# EAGLE design Pin-with-a-screen (EAGLE 7.6.0)
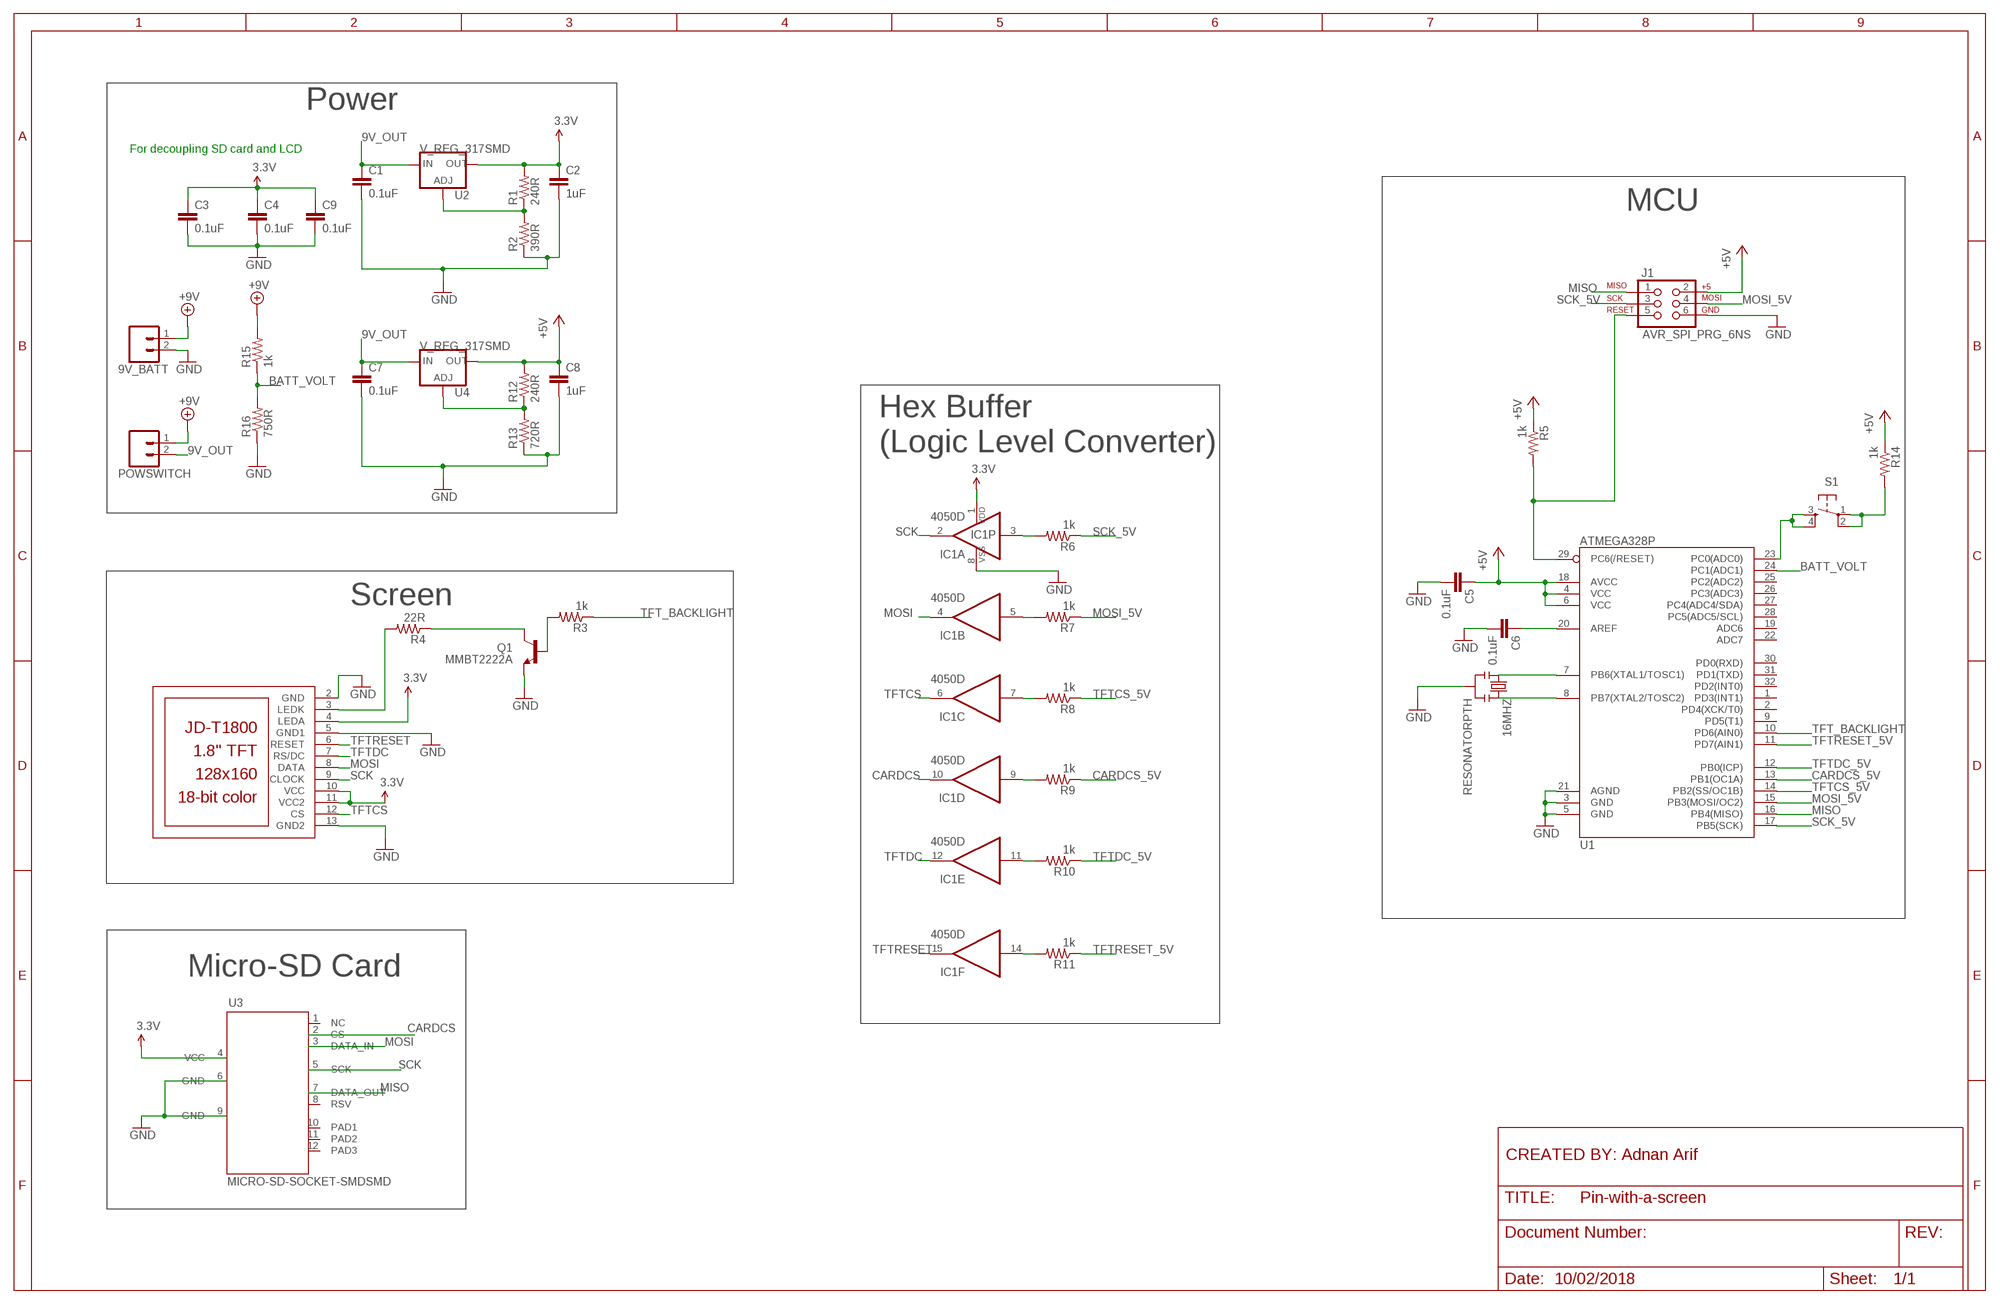
[diagram p0: schematic, sheet 1]
FRAME1 (FRAME_B_L): DATE: 10th Feb 2018

## Parts
9V_BATT  M02POGO_PIN_HOLES_ONLY  [1X02_PP_HOLES_ONLY]
16MHZ  RESONATORPTH  [RESONATOR-PTH]
C1  0.1uF  CAP0603-CAP  [0603-CAP]
C2  1uF  CAP0603-CAP  [0603-CAP]
C3  0.1uF  CAP0603-CAP  [0603-CAP]
C4  0.1uF  CAP0603-CAP  [0603-CAP]
C5  0.1uF  CAP0603-CAP  [0603-CAP]
C6  0.1uF  CAP0603-CAP  [0603-CAP]
C7  0.1uF  CAP0603-CAP  [0603-CAP]
C8  1uF  CAP0603-CAP  [0603-CAP]
C9  0.1uF  CAP0603-CAP  [0603-CAP]
IC1  4050D  [SO16]
J1  AVR_SPI_PRG_6NS  [2X3-NS]
LCD2  JD-T1800  [JD-T1800]
POWSWITCH  M02POGO_PIN_HOLES_ONLY  [1X02_PP_HOLES_ONLY]
Q1  MMBT2222A  TRANSISTOR_NPNMMBT2222A  [SOT23-3]
R1  240R  RESISTOR0603-RES  [0603-RES]
R2  390R  RESISTOR0603-RES  [0603-RES]
R3  1k  RESISTOR0603-RES  [0603-RES]
R4  22R  RESISTOR0603-RES  [0603-RES]
R5  1k  RESISTOR0603-RES  [0603-RES]
R6  1k  RESISTOR0603-RES  [0603-RES]
R7  1k  RESISTOR0603-RES  [0603-RES]
R8  1k  RESISTOR0603-RES  [0603-RES]
R9  1k  RESISTOR0603-RES  [0603-RES]
R10  1k  RESISTOR0603-RES  [0603-RES]
R11  1k  RESISTOR0603-RES  [0603-RES]
R12  240R  RESISTOR0603-RES  [0603-RES]
R13  720R  RESISTOR0603-RES  [0603-RES]
R14  1k  RESISTOR0603-RES  [0603-RES]
R15  1k  RESISTOR0603-RES  [0603-RES]
R16  750R  RESISTOR0603-RES  [0603-RES]
S1  TAC_SWITCHPTH  [TACTILE-PTH]
U1  ATMEGA328P  ATMEGA328_SMT  [TQFP32-08]
U2  V_REG_317SMD  [SOT223]
U3  MICRO-SD-SOCKET-SMDSMD  [MICRO-SD-SOCKET-SMD]
U4  V_REG_317SMD  [SOT223]

## Nets
3.3V: C2.1 C3.1 C4.1 C9.1 IC1.1(P:VDD) LCD2.4(LEDA) LCD2.10(VCC) LCD2.11(VCC2) R1.2 U2.2(OUT) U3.4(VCC)
9V_OUT: C1.1 C7.1 POWSWITCH.2 U2.3(IN) U4.3(IN)
+5V: C5.1 C8.1 J1.2 R5.1 R12.2 R14.1 U1.4(VCC) U1.6(VCC) U1.18(AVCC) U4.2(OUT)
+9V: 9V_BATT.1 POWSWITCH.1 R15.2
BATT_VOLT: R15.1 R16.2 U1.24(PC1(ADC1))
CARDCS: IC1.10(D:O) U3.2(CS)
CARDCS_5V: R9.1 U1.13(PB1(OC1A))
GND: 9V_BATT.2 16MHZ.2 C1.2 C2.2 C3.2 C4.2 C5.2 C6.2 C7.2 C8.2 C9.2 IC1.8(P:VSS) J1.6 LCD2.2(GND) LCD2.5(GND1) LCD2.13(GND2) Q1.2(E) R2.1 R13.1 R16.1 U1.3(GND) U1.5(GND) U1.21(AGND) U3.6(GND) U3.9(GND)
LEDK: LCD2.3(LEDK) R4.2
MISO: J1.1 U1.16(PB4(MISO)) U3.7(DATA_OUT)
MOSI: IC1.4(B:O) LCD2.8(DATA) U3.3(DATA_IN)
MOSI_5V: J1.4 R7.1 U1.15(PB3(MOSI/OC2))
N$1: S1.3 S1.4 U1.23(PC0(ADC0))
N$2: R14.2 S1.1 S1.2
N$3: C6.1 U1.20(AREF)
N$4: 16MHZ.1 U1.7(PB6(XTAL1/TOSC1))
N$5: 16MHZ.3 U1.8(PB7(XTAL2/TOSC2))
N$6: J1.5 R5.2 U1.29(PC6(/RESET))
N$7: IC1.3(A:I) R6.2
N$8: IC1.5(B:I) R7.2
N$9: IC1.7(C:I) R8.2
N$10: IC1.9(D:I) R9.2
N$11: IC1.11(E:I) R10.2
N$12: IC1.14(F:I) R11.2
N$14: R1.1 R2.2 U2.1(ADJ)
N$15: R12.1 R13.2 U4.1(ADJ)
SCK: IC1.2(A:O) LCD2.9(CLOCK) U3.5(SCK)
SCK_5V: J1.3 R6.1 U1.17(PB5(SCK))
TFT_BACKLIGHT: R3.1 U1.10(PD6(AIN0))
TFTCS: IC1.6(C:O) LCD2.12(CS)
TFTCS_5V: R8.1 U1.14(PB2(SS/OC1B))
TFTDC: IC1.12(E:O) LCD2.7(RS/DC)
TFTDC_5V: R10.1 U1.12(PB0(ICP))
TFTRESET: IC1.15(F:O) LCD2.6(RESET)
TFTRESET_5V: R11.1 U1.11(PD7(AIN1))
TRAN_BASE: Q1.1(B) R3.2
TRAN_COLLECTOR: Q1.3(C) R4.1
Unconnected: U1.1(PD3(INT1)) U1.2(PD4(XCK/T0)) U1.9(PD5(T1)) U1.19(ADC6) U1.22(ADC7) U1.25(PC2(ADC2)) U1.26(PC3(ADC3)) U1.27(PC4(ADC4/SDA)) U1.28(PC5(ADC5/SCL)) U1.30(PD0(RXD)) U1.31(PD1(TXD)) U1.32(PD2(INT0)) U3.1(NC) U3.8(RSV) U3.10(PAD1) U3.11(PAD2) U3.12(PAD3)

## Notes on the sheet
- Power
- For decoupling SD card and LCD
- MCU
- Hex Buffer
  (Logic Level Converter)
- Screen
- Micro-SD Card
- CREATED BY: Adnan Arif
- 10/02/2018

## Library data of the parts
9V_BATT POWSWITCH = SparkFun-Connectors:M02: Standard 2-pin 0.1" header. Use with - straight break away headers ( PRT-00116) - right angle break away headers (PRT-00553) - swiss pins (PRT-00743) - machine pins (PRT-00117) - female headers (PRT-00115) Molex polarized connector foot print use with: PRT-08233 with associated crimp pins and housings. 2.54_SCREWTERM for use with PRT-10571. 3.5mm Screw Terminal footprints for PRT-08084 5mm Screw Terminal footprints for use with PRT-08433
16MHZ = SparkFun:RESONATOR: Resonator Small SMD resonator. This is the itty bitty 10/20MHz resonators with built in caps. CSTCE10M0G55 and CSTCE20M0V53. Footprint has been reviewed closely but hasn't been tested yet.
C1-C9 = SparkFun:CAP: Capacitor Standard 0603 ceramic capacitor, and 0.1" leaded capacitor.
IC1 = 40xx:4050: Hex non-inverting BUFFER
J1 = SparkFun-Connectors:AVR_SPI_PRG_6: AVR ISP 6 Pin This is the reduced ISP connector for AVR programming. Common on Arduino. This footprint will take up less PCB space and can be used with a 10-pin to 6-pin adapter such as SKU: BOB-08508
LCD2 = adafruit:JD-T1800
Q1 = SparkFun-DiscreteSemi:TRANSISTOR_NPN: Generic NPN BJT MMBT2222A - TRANS-08049 (SOT-23, 1A 40V) MPSA42 - TRANS-09116 (SOT-23, 500mA 300V) MMBT5088LT1G - TRANS-11160 (SOT-23, 50 mA 30V); PROD_ID: TRANS-08049
R1-R16 = SparkFun-Passives:RESISTOR: Resistor Basic schematic elements and footprints for 0603, 1206, and PTH resistors.
S1 = SparkFun-Electromechanical:TAC_SWITCH: Momentary Switch Button commonly used for reset or general input. Spark Fun Electronics SKU : COM-00097 SMT- SWCH-08247
U1 = SparkFun-DigitalIC:ATMEGA328_SMT: 32-Pin Atmega328 part Commonly used on Arduino compatible boards Available in QFP and QFN packages TQFP is IC-09069 QFN is non-stock; PROD_ID: IC-09069
U2 U4 = SparkFun:V_REG_317: Voltage Regulator Standard LM317 adjustable voltage regulator. AOI (Adjust Output Input). Google 'LM317 Calculator' for easy to use app to get the two resistor values needed. 240/720 for 5V output. 240/390 for 3.3V output. Spark Fun Electronics SKU : COM-00527
U3 = SD-library-Adnan:MICRO-SD-SOCKET-SMD: This footprint was created for a Transflash TF micro SD card socket purchased from eBay in Feb 2018. Link (could break over time): https://www.ebay.com/itm/171297065693?ViewItem=&item=171297065693

## Board
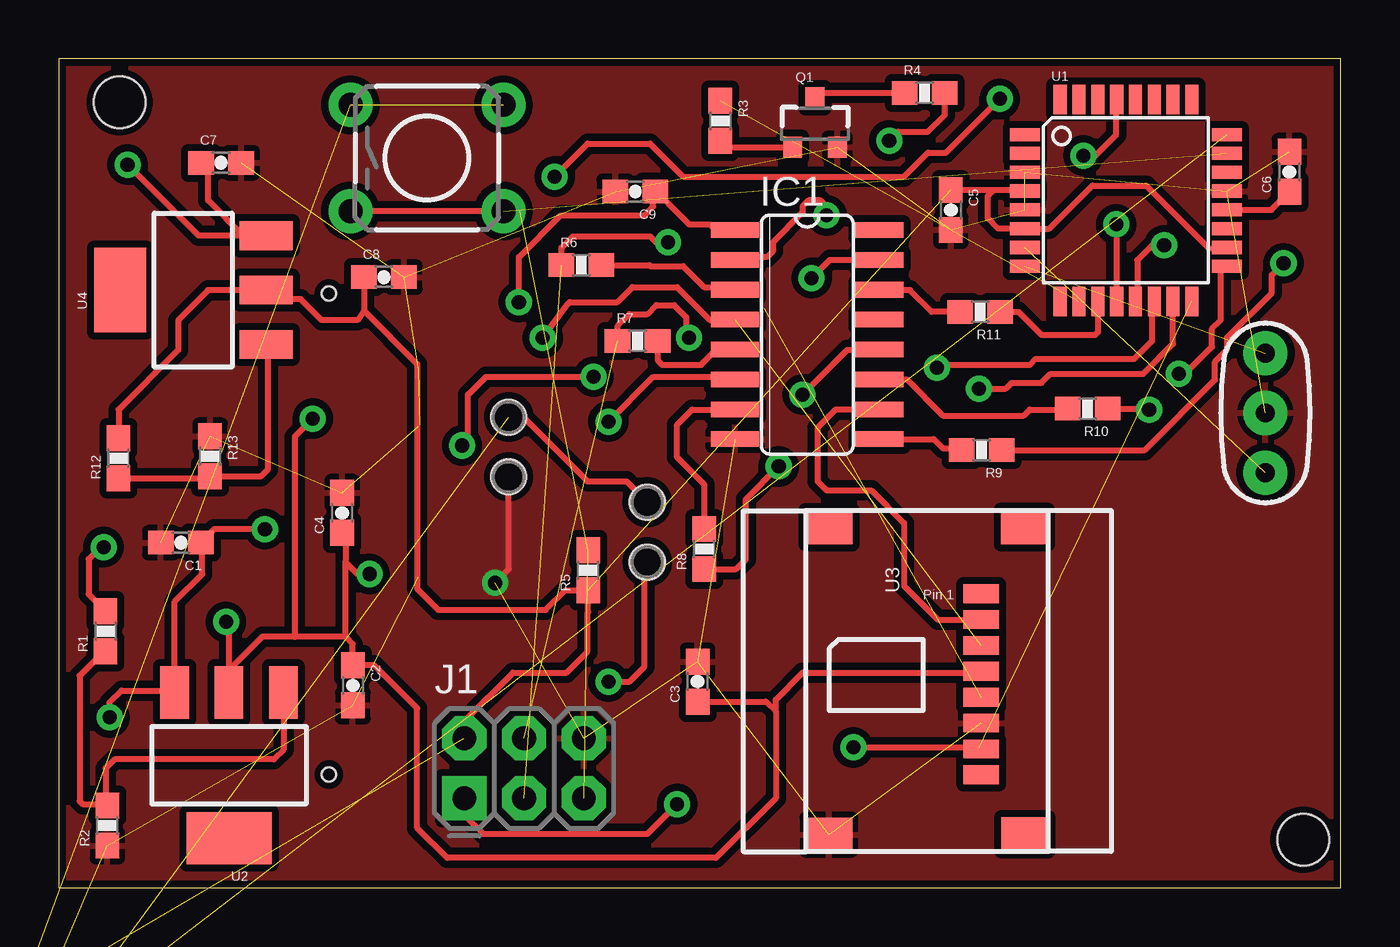
[diagram p1: board, top side]
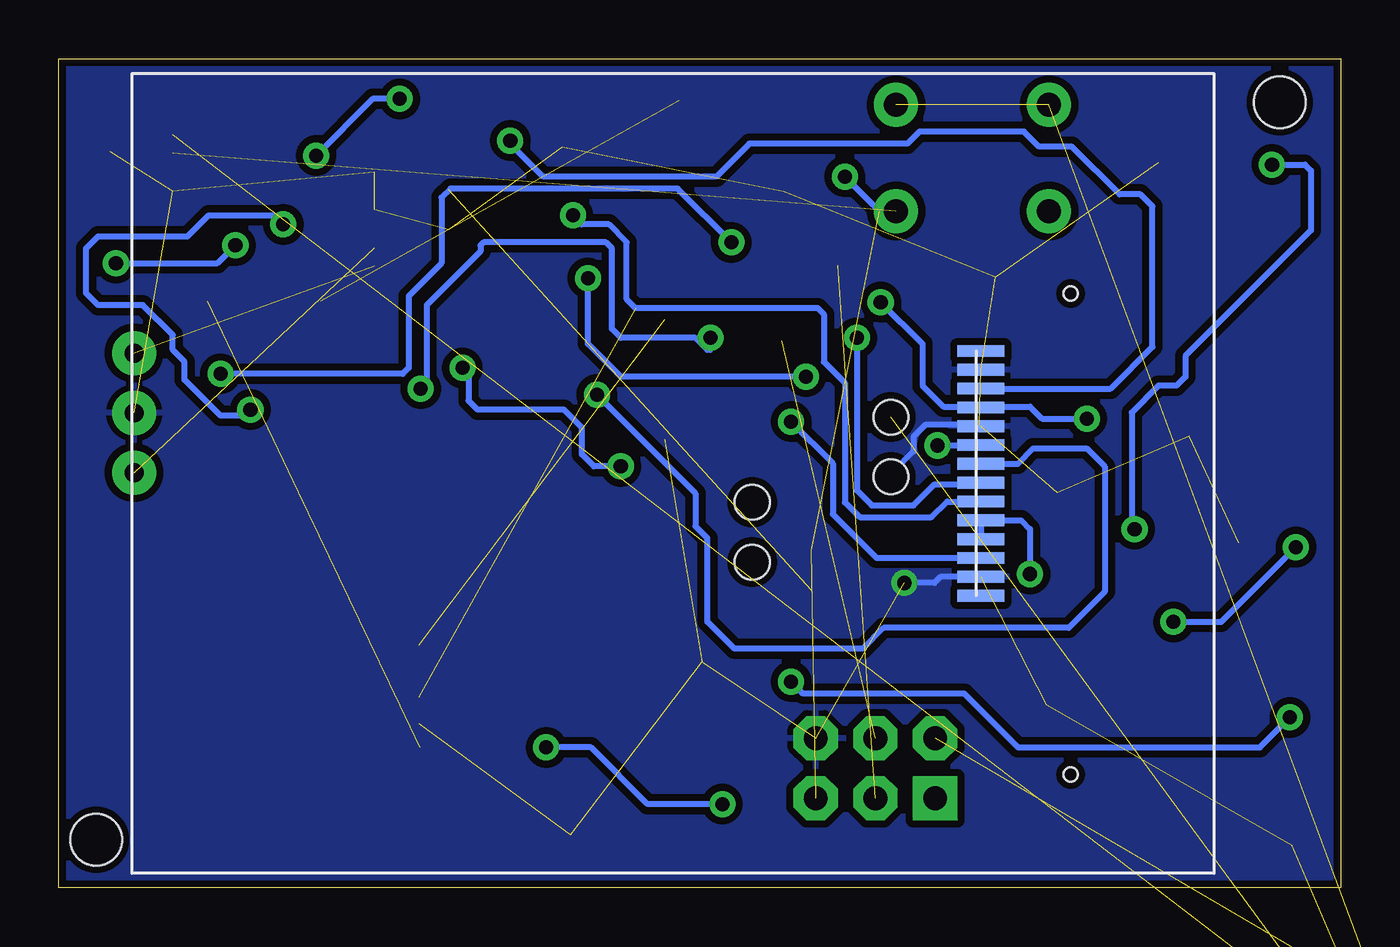
[diagram p2: board, bottom side, seen from below]

Size 54.5 x 35.23 mm. Coordinates in mm from the lower left corner, seen from the top.
Outline: 0,0 54.5,0 54.5,35.23 0,35.23 0,0
Copper layers (1*16): Top 0.035mm / dielectric 1.5mm / Bottom 0.035mm
Design rules "SparkFun": minimum track width 8mil, minimum drill 20mil, track to track 8mil, track to pad 8mil, pad to pad 8mil, via to via 8mil, smd to smd 8mil, copper to edge 8mil, drill to drill 8mil, minimum pad ring 12mil, minimum via ring 10mil, stop-mask expansion 4mil, vias tented up to drill 20mil, thermal gap 10mil
Holes 2.2 mm at 2.59,33.39 52.91,2.05

### Footprints (pad centres in the part's own frame; a part is rotated, then mirrored left to right if it is on the bottom)
1X02_PP_HOLES_ONLY = drill 0.889 pad 0.813: 1 0,0; 2 2.54,0 | hole 1.473: 0,0; 2.54,0
RESONATOR-PTH = drill 0.8 pad 1.88: 1 -2.54,0; 2 0,0; 3 2.54,0
0603-CAP = smd 1.1 x 1: 1 -0.85,0; 2 0.85,0
SO16 = smd 0.66 x 2.032: 1 -4.445,-3.073; 2 -3.175,-3.073; 3 -1.905,-3.073; 4 -0.635,-3.073; 5 0.635,-3.073; 6 1.905,-3.073; 7 3.175,-3.073; 8 4.445,-3.073; 9 4.445,3.073; 10 3.175,3.073; 11 1.905,3.073; 12 0.635,3.073; 13 -0.635,3.073; 14 -1.905,3.073; 15 -3.175,3.073; 16 -4.445,3.073
2X3-NS = drill 1.016 pad 1.88 square: 1 -2.54,-1.27 | drill 1.016 pad 1.88 octagon: 2 -2.54,1.27; 3 0,-1.27; 4 0,1.27; 5 2.54,-1.27; 6 2.54,1.27
JD-T1800 = smd 0.5 x 2: 1 5.2,-13.1; 2 4.4,-13.1; 3 3.6,-13.1; 4 2.8,-13.1; 5 2,-13.1; 6 1.2,-13.1; 7 0.4,-13.1; 8 -0.4,-13.1; 9 -1.2,-13.1; 10 -2,-13.1; 11 -2.8,-13.1; 12 -3.6,-13.1; 13 -4.4,-13.1; 14 -5.2,-13.1 | hole 0.6: -12.8,-16.9; 7.65,-16.9
SOT23-3 = smd 0.8 x 0.9: 1 -0.95,-1; 2 0.95,-1; 3 0,1.1
0603-RES = smd 1.1 x 1: 1 -0.85,0; 2 0.85,0
TACTILE-PTH = drill 1.016 pad 1.88: 1 -3.251,2.261; 2 3.251,2.261; 3 -3.251,-2.261; 4 3.251,-2.261
TQFP32-08 = smd 1.27 x 0.559: 1 -4.293,2.8; 2 -4.293,2; 3 -4.293,1.2; 4 -4.293,0.4; 5 -4.293,-0.4; 6 -4.293,-1.2; 7 -4.293,-2; 8 -4.293,-2.8; 17 4.293,-2.8; 18 4.293,-2; 19 4.293,-1.2; 20 4.293,-0.4; 21 4.293,0.4; 22 4.293,1.2; 23 4.293,2; 24 4.293,2.8 | smd 0.559 x 1.27: 9 -2.8,-4.293; 10 -2,-4.293; 11 -1.2,-4.293; 12 -0.4,-4.293; 13 0.4,-4.293; 14 1.2,-4.293; 15 2,-4.293; 16 2.8,-4.293; 25 2.8,4.293; 26 2,4.293; 27 1.2,4.293; 28 0.4,4.293; 29 -0.4,4.293; 30 -1.2,4.293; 31 -2,4.293; 32 -2.8,4.293
SOT223 = smd 1.219 x 2.235: 1 -2.311,-3.099; 2 0,-3.099; 3 2.311,-3.099 | smd 3.6 x 2.2: 4 0,3.099
MICRO-SD-SOCKET-SMD = smd 0.8 x 1.5: 1 10.96,5.54; 2 9.86,5.54; 3 8.76,5.54; 4 7.66,5.54; 5 6.56,5.54; 6 5.46,5.54; 7 4.36,5.54; 8 3.26,5.54 | smd 1.45 x 2: 9 0.72,12.01; 10 13.78,12; 11 0.73,3.68; 12 13.79,3.69

### Placement (x,y rotation side)
9V_BATT  19.13,20 270 top
16MHZ  51.3,20.18 90 top
C1  5.19,14.67 180 top
C2  12.5,8.6 270 top
C3  27.16,8.76 90 top
C4  12.05,15.94 90 top
C5  37.92,28.81 270 top
C6  52.32,30.43 90 top
C7  6.9,30.81 0 top
C8  13.82,25.96 0 top
C9  24.51,29.59 180 top
IC1  31.82,23.51 270 top
J1  19.78,5.08 0 top
LCD2  28.39,17.62 90 bottom
POWSWITCH  25.02,16.38 270 top
Q1  32.15,32.47 0 top
R1  1.99,10.91 90 top
R2  2.06,2.65 90 top
R3  28.13,32.59 270 top
R4  36.81,33.78 0 top
R5  22.51,13.49 90 top
R6  22.22,26.46 0 top
R7  24.61,23.25 0 top
R8  27.45,14.4 90 top
R9  39.23,18.6 180 top
R10  43.74,20.37 180 top
R11  39.17,24.48 180 top
R12  2.54,18.25 90 top
R13  6.43,18.34 270 top
R14  -3,-6 0 top  (outside the outline)
R15  -3,-9 0 top  (outside the outline)
R16  -3,-12 0 top  (outside the outline)
S1  15.66,31.02 0 top
U1  45.37,29.21 0 top
U2  7.24,5.21 180 top
U3  44.75,1.54 90 top
U4  5.71,25.4 90 top

### Tracks (layer width: path | path; a pad name or v marks a point on that pad's centre or on a via)
3.3V  (via drill 0.6)
  Top 0.254: U2.2 7.24,9.27 | 7.24,9.27 7.24,11.18 v7.11,11.3 | v1.91,14.48 1.78,14.48 1.27,13.97 1.27,12.48 R1.2 | 7.24,9.27 8.64,10.67 10.03,10.67 | 12.19,10.67 12.5,10.36 C2.1 13.41,9.45 15.24,7.62 15.24,2.54 16.51,1.27 27.94,1.27 30.48,3.81 30.48,7.49 | 12.19,10.67 10.03,10.67 | IC1.1 28.73,27.94 27.94,27.94 27.69,28.19 26.8,28.19 25.91,29.08 C9.1 25.27,29.5 25.27,28.96 24.89,28.57 21.34,28.57 19.56,26.8 v19.56,24.89 | v10.79,19.94 10.03,19.18 10.03,10.67 | C4.1 12.19,14.94 12.19,13.84 | 12.19,13.84 12.7,13.34 v13.21,13.34 | 12.19,10.67 12.19,13.84 | C3.1 30.06,7.91 30.48,7.49 | 30.48,7.49 30.48,8 31.62,9.14 39.15,9.14 U3.4
  Bottom 0.254: v7.11,11.3 5.08,11.3 v1.91,14.48 | v13.21,13.34 13.21,15.24 13.58,15.62 LCD2.10 LCD2.11 | v19.56,24.89 17.78,23.11 17.78,21.34 16.89,20.45 15.32,20.45 LCD2.4 15.26,20.45 13.21,20.45 12.7,19.94 v10.79,19.94
9V_OUT  (via drill 0.6)
  Top 0.254: U4.3 7.85,27.71 | 7.85,27.71 6.35,29.21 6.35,30.51 C7.1 | U2.3 4.93,8.89 | 4.93,8.89 4.93,12.17 6.1,13.34 6.1,14.61 C1.1 6.61,15.24 v8.76,15.24 | v2.16,7.24 2.16,7.87 2.67,8.38 4.42,8.38 4.93,8.89 | 7.85,27.71 5.94,27.71 v2.92,30.73 | POWSWITCH.2 24.89,13.72 24.89,9.4 24.26,8.76 v23.37,8.76
  Bottom 0.254: v2.16,7.24 3.43,5.97 13.72,5.97 16,8.26 22.86,8.26 v23.37,8.76 | v2.92,30.73 1.52,30.73 1.27,30.48 1.27,27.94 6.6,22.61 6.6,21.72 6.99,21.34 7.75,21.34 8.89,20.19 8.89,15.37 v8.76,15.24
+5V  (2 unrouted)
  Top 0.254: R12.2 2.54,20.32 5.08,22.86 5.08,24.13 6.35,25.4 U4.2 9.2,25.02 10.29,25.02 11.18,24.13 12.7,24.13 12.97,24.53 | J1.2 17.24,7.08 19.3,9.14 21.59,9.14 22.48,10.03 22.48,11.68 22.51,11.71 R5.1 21.53,12.64 20.7,11.81 16.13,11.81 15.24,12.7 15.24,22.26 12.97,24.53 | C8.1 12.97,24.53 | C5.1 39.75,29.66 | 39.75,29.66 41.03,29.66 U1.4 | 39.75,29.66 39.5,29.4 39.5,28.45 39.94,28.01 U1.6 42.11,28.01 43.94,29.84 46.23,29.84 48.9,27.18 49.63,27.18 U1.18
+9V  (1 unrouted)
  Top 0.254: 9V_BATT.1 19.75,20 22.48,17.27 24.13,17.27 POWSWITCH.1
BATT_VOLT  (2 unrouted)
CARDCS
  Top 0.254: IC1.10 34.88,20.32 33.02,20.32 32.26,19.56 32.26,17.27 32.64,16.89 34.54,16.89 35.94,15.49 35.94,12.83 37.37,11.4 U3.2
CARDCS_5V  (via drill 0.6)
  Top 0.254: R9.1 46.16,18.6 49.15,21.59 49.15,22.35 49.66,22.86 49.66,23.37 51.56,25.27 51.56,26.04 v52.07,26.54 | v46.99,27.3 46.48,27.3 45.85,26.67 45.85,24.99 U1.13
  Bottom 0.254: v52.07,26.54 47.75,26.54 v46.99,27.3
GND  (via drill 0.6)  (22 unrouted)
  Top 0.254: v18.54,12.95 19.13,13.54 9V_BATT.2
  Bottom 0.254: LCD2.5 15.36,19.68 17.65,19.68 18.16,19.18 18.16,18.54 19,17.7 9V_BATT.2 | LCD2.13 15.3,13.21 17.02,13.21 17.27,12.95 v18.54,12.95
  pour Top (isolate 0.305): -5.08,37.85 -5.08,-3.81 59.18,-3.81 59.18,37.85
  pour Bottom (isolate 0.305): -2.54,36.45 -2.54,-1.27 56.64,-1.27 56.64,36.45
LEDK  (via drill 0.6)
  Top 0.254: v35.31,31.75 35.69,32.13 36.96,32.13 37.66,32.84 R4.2
  Bottom 0.254: LCD2.3 15.28,21.21 9.78,21.21 8,22.99 8,28.96 8.51,29.46 9.4,29.46 11.43,31.5 12.83,31.5 13.46,32.13 17.91,32.13 18.41,31.62 25.15,31.62 26.54,30.23 33.91,30.23 35.31,31.62 v35.31,31.75
MISO  (via drill 0.6)  (1 unrouted)
  Top 0.254: J1.1 17.24,3.08 18.03,2.29 25.02,2.29 v26.29,3.56 | v33.78,5.97 39.14,5.97 U3.7
  Bottom 0.254: v26.29,3.56 29.46,3.56 31.88,5.97 v33.78,5.97
MOSI  (via drill 0.6)  (1 unrouted)
  Top 0.254: v20.57,23.37 21.59,24.77 21.72,24.89 23.75,24.89 24.38,25.53 26.29,25.53 27.69,24.13 28.73,24.13 IC1.4
  Bottom 0.254: LCD2.8 15.36,17.14 17.27,17.14 18.16,16.26 19.94,16.26 20.57,16.89 v20.57,23.37
MOSI_5V  (via drill 0.6)  (1 unrouted)
  Top 0.254: R7.1 23.76,23.88 24.26,24.38 25.02,24.38 25.4,24.77 26.16,24.77 26.67,24.26 26.67,23.5 v26.8,23.37 | v39.12,21.21 40.26,21.21 40.51,21.46 41.78,21.46 42.16,21.84 46.1,21.84 47.37,23.11 U1.15
  Bottom 0.254: v26.8,23.37 26.8,22.86 26.92,22.86 27.43,23.37 30.61,23.37 30.99,23.75 30.99,27.18 31.24,27.43 36.45,27.43 36.58,27.3 36.58,27.05 38.86,24.77 38.86,21.46 v39.12,21.21
N$1  (1 unrouted)
  Top 0.254: S1.4 S1.3
N$2  (2 unrouted)
N$3
  Top 0.254: U1.20 51.55,28.81 C6.1
N$4  (1 unrouted)
N$5  (1 unrouted)
N$6  (via drill 0.6)  (2 unrouted)
  Top 0.254: v21.08,30.23 22.48,31.62 25.15,31.62 26.54,30.23 35.94,30.23 36.96,31.24 37.72,31.24 v40.01,33.53 | v43.56,31.11 44.07,31.11 44.96,32 44.96,33.49 U1.29
  Bottom 0.254: 19.61,28.75 v21.08,30.23 | v40.01,33.53 41.15,33.53 v43.56,31.11
N$7
  Top 0.254: R6.2 25.1,26.46 25.15,26.42 26.54,26.42 27.43,25.53 28.64,25.53 IC1.3
N$8
  Top 0.254: R7.2 25.46,22.42 25.65,22.23 27.3,22.23 27.81,22.73 28.61,22.73 IC1.5
N$9
  Top 0.254: R8.2 27.45,17.13 26.29,18.29 26.29,19.68 26.92,20.32 28.73,20.32 IC1.7
N$10
  Top 0.254: IC1.9 37.2,19.07 37.59,18.67 38.32,18.67 R9.2
N$11
  Top 0.254: IC1.11 36.05,21.61 37.59,20.07 41.02,20.07 41.27,20.32 42.84,20.32 R10.2
N$12
  Top 0.254: R11.2 37.12,24.48 36.2,25.4 34.91,25.4 IC1.14
N$14
  Top 0.254: U2.1 9.55,5.87 9.14,5.46 2.37,5.46 1.99,5.08 1.99,3.57 R2.2 2,3.56 1.02,3.56 0.89,3.68 0.89,9.02 1.93,10.06 R1.1
N$15
  Top 0.254: U4.1 8.89,23.01 8.89,17.78 8.6,17.49 R13.2 6.35,17.4 R12.1
SCK  (via drill 0.6)  (1 unrouted)
  Top 0.254: v32.64,28.57 32.64,28.96 32.38,29.21 31.88,29.21 31.62,28.96 31.62,28.7 30.35,27.43 30.35,27.05 30.1,26.8 28.86,26.8 IC1.2
  Bottom 0.254: LCD2.9 16.73,16.42 17.4,15.75 20.45,15.75 21.08,16.38 21.08,21.46 21.97,22.35 21.97,24.38 22.23,24.64 29.97,24.64 30.35,25.02 30.35,27.43 31.11,28.19 32.26,28.19 v32.64,28.57
SCK_5V  (via drill 0.6)  (1 unrouted)
  Top 0.254: v25.91,27.43 25.4,27.43 25.15,27.69 21.84,27.69 21.37,27.21 R6.1 | v47.62,21.84 47.88,21.84 49.02,22.99 49.02,23.75 49.4,24.13 49.4,26.15 U1.17
  Bottom 0.254: v47.62,21.84 39.88,21.84 39.62,22.1 39.62,25.15 38.23,26.54 38.23,29.34 37.85,29.72 28.19,29.72 v25.91,27.43
TFT_BACKLIGHT  (1 unrouted)
TFTCS  (via drill 0.6)
  Top 0.254: 28.73,21.59 IC1.6 28.64,21.72 25.27,21.72 v23.37,19.81
  Bottom 0.254: LCD2.12 19.73,14.02 21.59,15.88 21.59,18.03 v23.37,19.81
TFTCS_5V  (via drill 0.6)
  Top 0.254: v37.34,22.1 37.72,22.1 37.85,22.23 41.27,22.23 41.53,22.48 45.72,22.48 46.48,23.24 46.48,24.83 U1.14 | R8.1 28.79,13.55 29.21,13.97 29.21,16.51 v30.61,17.91
  Bottom 0.254: v30.61,17.91 31.75,17.91 32.26,18.41 32.26,19.56 33.02,20.32 36.7,20.32 37.08,20.7 37.08,21.84 v37.34,22.1
TFTDC  (via drill 0.6)
  Top 0.254: v31.62,20.95 33.53,22.86 34.88,22.86 IC1.12
  Bottom 0.254: LCD2.7 13.73,18.02 13.08,18.67 10.79,18.67 10.03,17.91 10.03,12.57 11.56,11.05 19.43,11.05 20.32,10.16 25.78,10.16 26.92,11.3 26.92,14.86 27.43,15.37 27.43,16.76 v31.62,20.95
TFTDC_5V  (via drill 0.6)
  Top 0.254: R10.1 46.31,20.37 v46.35,20.32 | v44.96,28.19 44.96,24.93 U1.12
  Bottom 0.254: v46.35,20.32 46.48,20.32 46.74,20.07 47.62,20.07 49.15,21.59 49.15,22.35 49.66,22.86 49.66,23.5 50.93,24.77 52.83,24.77 53.34,25.27 53.34,27.18 52.83,27.69 49.02,27.69 48.13,28.57 45.34,28.57 v44.96,28.19
TFTRESET  (via drill 0.6)
  Top 0.254: v17.14,18.8 17.4,19.05 17.4,20.95 18.16,21.72 v22.73,21.72 | v32,25.91 32.78,26.68 IC1.15
  Bottom 0.254: LCD2.6 15.31,18.8 v17.14,18.8 | v22.73,21.72 30.61,21.72 32,23.11 v32,25.91
TFTRESET_5V
  Top 0.254: R11.1 40.8,24.48 41.78,23.5 44.07,23.5 44.2,23.62 44.2,24.89 U1.11
TRAN_BASE
  Top 0.254: R3.2 28.4,31.47 Q1.1
TRAN_COLLECTOR
  Top 0.254: Q1.3 32.36,33.78 R4.1